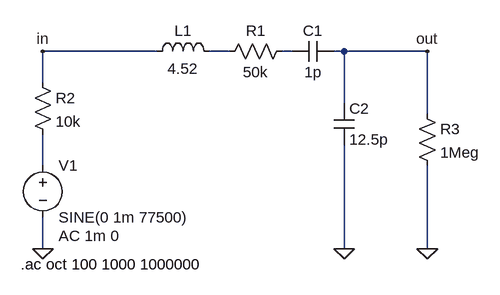
[diagram p0: schematic 01_Crystal_AC-analysis.asc]
01_Crystal_AC-analysis.asc, the LTspice schematic file:
Version 4
SHEET 1 880 680
WIRE 48 16 -128 16
WIRE 160 16 128 16
WIRE 256 16 240 16
WIRE 336 16 320 16
WIRE 464 16 336 16
WIRE -128 64 -128 16
WIRE 336 96 336 16
WIRE 464 112 464 16
WIRE -128 192 -128 144
WIRE -128 320 -128 272
WIRE 336 320 336 160
WIRE 464 320 464 192
FLAG -128 320 0
FLAG 464 320 0
FLAG 464 16 out
FLAG -128 16 in
FLAG 336 320 0
SYMBOL ind 32 32 R270
WINDOW 0 32 56 VTop 2
WINDOW 3 5 56 VBottom 2
SYMATTR InstName L1
SYMATTR Value 4.52
SYMBOL cap 320 0 R90
WINDOW 0 0 32 VBottom 2
WINDOW 3 32 32 VTop 2
SYMATTR InstName C1
SYMATTR Value 1p
SYMBOL res 256 0 R90
WINDOW 0 0 56 VBottom 2
WINDOW 3 32 56 VTop 2
SYMATTR InstName R1
SYMATTR Value 50k
SYMBOL voltage -128 176 R0
WINDOW 123 24 124 Left 2
WINDOW 39 0 0 Left 0
SYMATTR InstName V1
SYMATTR Value SINE(0 1m 77500)
SYMATTR Value2 AC 1m 0
SYMBOL res -144 48 R0
SYMATTR InstName R2
SYMATTR Value 10k
SYMBOL res 448 96 R0
SYMATTR InstName R3
SYMATTR Value 1Meg
SYMBOL cap 320 96 R0
SYMATTR InstName C2
SYMATTR Value 12.5p
TEXT -162 344 Left 2 !.ac oct 100 1000 1000000

The netlist it stands for:
* 01_Crystal_AC-analysis.asc
L1 in N001 4.52
C1 out N002 1p
R1 N002 N001 50k
V1 N003 0 SINE(0 1m 77500) AC 1m 0
R2 in N003 10k
R3 out 0 1Meg
C2 out 0 12.5p
.ac oct 100 1000 1000000
.backanno
.end